# EAGLE design crt13n (EAGLE 7.6.0)
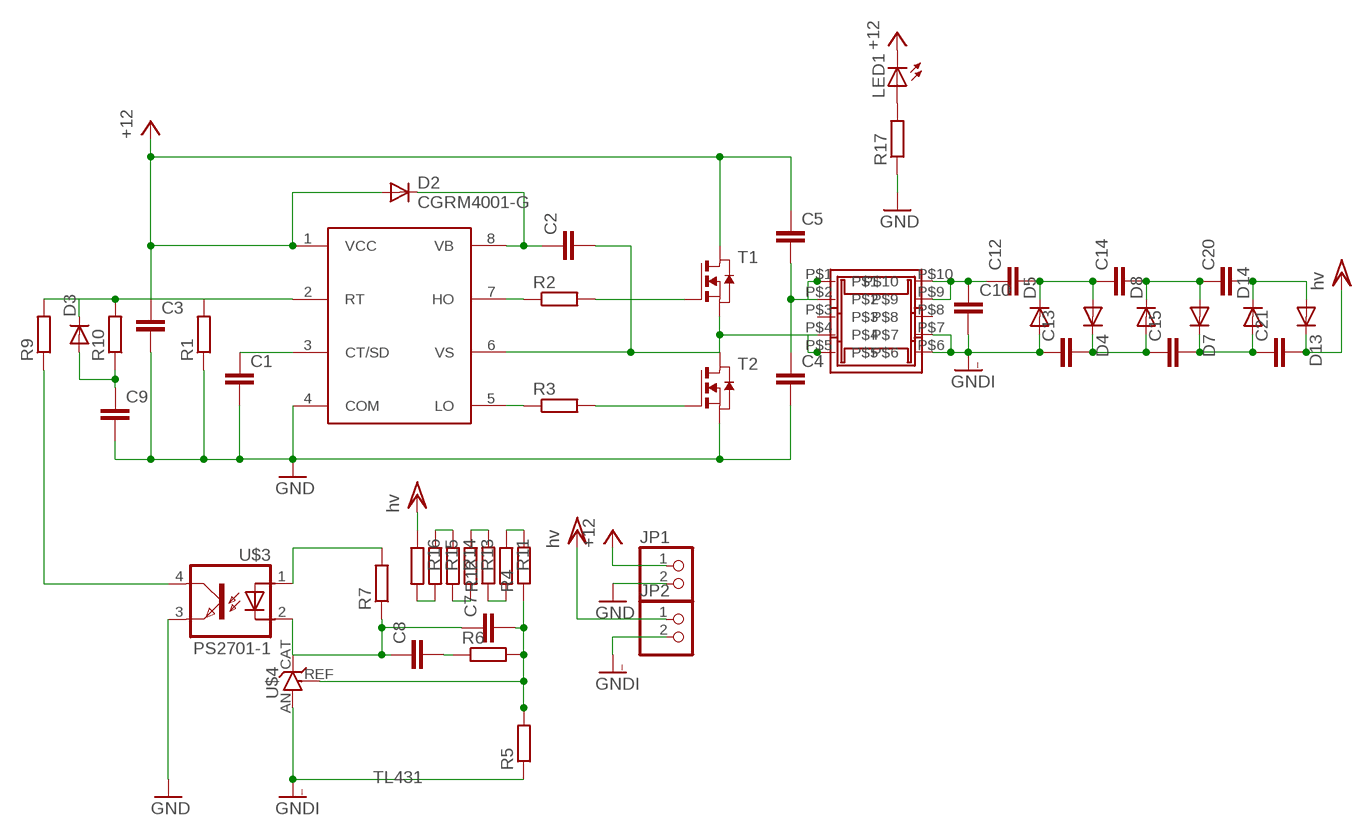
[diagram p0: schematic, sheet 1]

## Parts
C1  C-EUC0805  [C0805]
C2  C-EUC0805  [C0805]
C3  C-EUC1206  [C1206]
C4  CC1206  [C1206]
C5  CC1206  [C1206]
C7  C-EUC0805  [C0805]
C8  C-EUC0805  [C0805]
C9  C-EUC1206  [C1206]
C10  C-EUC1812  [C1812]
C12  C-EUC2220K  [C2220K]
C13  C-EUC2220K  [C2220K]
C14  C-EUC2220K  [C2220K]
C15  C-EUC2220K  [C2220K]
C20  C-EUC2220K  [C2220K]
C21  C-EUC2220K  [C2220K]
D2  CGRM4001-G  [SOD-123_MINI-SMA]
D3  DIODE-SOD80C  [SOD80C]
D4  DIODE-DO-214AC  [DO-214AC]
D5  DIODE-DO-214AC  [DO-214AC]
D7  DIODE-DO-214AC  [DO-214AC]
D8  DIODE-DO-214AC  [DO-214AC]
D13  DIODE-DO-214AC  [DO-214AC]
D14  DIODE-DO-214AC  [DO-214AC]
JP1  PINHD-1X2  [1X02]
JP2  PINHD-1X2  [1X02]
LED1  LEDCHIP-LED0805  [CHIP-LED0805]
R1  R-EU_R0805  [R0805]
R2  R-EU_R0805  [R0805]
R3  R-EU_R0805  [R0805]
R4  R-EU_R0805  [R0805]
R5  R-EU_R0805  [R0805]
R6  R-EU_R0805  [R0805]
R7  R-EU_R0805  [R0805]
R9  R-EU_R0805  [R0805]
R10  R-EU_R0805  [R0805]
R11  R-EU_R0805  [R0805]
R12  R-EU_R0805  [R0805]
R13  R-EU_R0805  [R0805]
R14  R-EU_R0805  [R0805]
R15  R-EU_R0805  [R0805]
R16  R-EU_R0805  [R0805]
R17  R-EU_R0805  [R0805]
T1  NMOSSOT23  [SOT-23]
T2  NMOSSOT23  [SOT-23]
U$1  IRS2795  [SO08]
U$2  EFD15-K-10P  [EFD15-K10P]
U$3  PS2701-1  [SOP04]
U$4  TL431  [SOT23]

## Nets
GND: C1.2 C3.2 C4.2 C9.2 JP1.2 R1.1 R17.1 T2.2(S) U$1.4(COM) U$3.3
GNDI: C10.2 C13.1 D5.A JP2.2 R5.1 U$2.P$6 U$2.P$7 U$4.AN
N$1: R7.2 U$3.1
N$2: C2.1 D2.C U$1.8(VB)
N$3: C1.1 U$1.3(CT/SD)
N$4: LED1.A R17.2
N$5: D3.C R1.2 R9.2 R10.2 U$1.2(RT)
N$6: R3.1 U$1.5(LO)
N$7: R2.1 U$1.7(HO)
N$10: C2.2 T1.2(S) T2.1(D) U$1.6(VS) U$2.P$4 U$2.P$5
N$11: R3.2 T2.3(G)
N$12: R2.2 T1.3(G)
N$13: C7.2 R4.1 R5.2 R6.2 U$4.REF
N$14: C8.2 R6.1
N$15: C7.1 C8.1 R7.1 U$3.2 U$4.CAT
N$16: R9.1 U$3.4
N$17: R4.2 R11.1
N$18: R11.2 R12.1
N$19: C10.1 C12.1 U$2.P$9 U$2.P$10
N$20: R12.2 R13.1
N$21: C9.1 D3.A R10.1
N$22: C12.2 C14.1 D4.A D5.C
N$23: R13.2 R14.2
N$24: R14.1 R15.1
N$25: R15.2 R16.2
N$27: C13.2 C15.1 D4.C D8.A
N$28: C14.2 C20.1 D7.A D8.C
N$31: C20.2 D13.A D14.C
N$32: C15.2 C21.1 D7.C D14.A
N$37: C4.1 C5.2 U$2.P$1 U$2.P$2
VCC: C3.1 C5.1 D2.A JP1.1 LED1.C T1.1(D) U$1.1(VCC) ; supply symbol labelled +12
VCC/2: C21.2 D13.C JP2.1 R16.1 ; supply symbol labelled hv
Unconnected: U$2.P$3 U$2.P$8

## Library data of the parts
C1-C3 C7-C10 C12-C15 C20 C21 = rcl:C-EU: CAPACITOR, European symbol
C4 C5 = eagle-ltspice:C: CAPACITOR, European symbol; SPICEMODEL: NONE; SPICEPREFIX: C
D2 = diode:CGRM400*-G: Molded plasitc,JEDEC SOD-123/Mini SMA Source: Comchip CGRM4001-G.pdf
D3-D5 D7 D8 D13 D14 = diode:DIODE-: DIODE
JP1 JP2 = pinhead:PINHD-1X2: PIN HEADER
LED1 = adafruit:LED: LED OSRAM: - CHIPLED LG R971, LG N971, LY N971, LG Q971, LY Q971, LO R971, LY R971 LH N974, LH R974 LS Q976, LO Q976, LY Q976 LO Q996 - Hyper CHIPLED LW Q18S LB Q993, LB Q99A, LB R99A - SideLED LS A670, LO A670, LY A670, LG A670, LP A670 LB A673, LV A673, LT A673, LW A673 LH A674 LY A675 LS A676, LA A676, LO A676, LY A676, LW A676 LS A679, LY A679, LG A679 - Hyper Micro SIDELED® LS Y876, LA Y876, LO Y876, LY Y876 LT Y87S - SmartLED LW L88C, LW L88S LB L89C, LB L89S, LG L890 LS L89K, LO L89K, LY L89K LS L896, LA L896, LO L896, LY L896 - TOPLED LS T670, LO T670, LY T670, LG T670, LP T670 LSG T670, LSP T670, LSY T670, LOP T670, LYG T670 LG T671, LOG T671, LSG T671 LB T673, LV T673, LT T673, LW T673 LH T674 LS T676, LA T676, LO T676, LY T676, LB T676, LH T676, LSB T676, LW T676 LB T67C, LV T67C, LT T67C, LS T67K, LO T67K, LY T67K, LW E67C LS E67B, LA E67B, LO E67B, LY E67B, LB E67C, LV E67C, LT E67C LW T67C LS T679, LY T679, LG T679 LS T770, LO T770, LY T770, LG T770, LP T770 LB T773, LV T773, LT T773, LW T773 LH T774 LS E675, LA E675, LY E675, LS T675 LS T776, LA T776, LO T776, LY T776, LB T776 LHGB T686 LT T68C, LB T68C - Hyper Mini TOPLED® LB M676 - Mini TOPLED Santana® LG M470 LS M47K, LO M47K, LY M47K Source: http://www.osram.convergy.de/
R1-R7 R9-R17 = rcl:R-EU_: RESISTOR, European symbol
T1 T2 = zetex:NMOSSOT23: MOS FET; OC_FARNELL: unknown; OC_NEWARK: unknown
U$1 = ir:IRS2795
U$2 = EFD15-K-10P:EFD15-K-10P
U$3 = PHOTOCOUPLER:PS2701-1
U$4 = reg:TL431

## Board
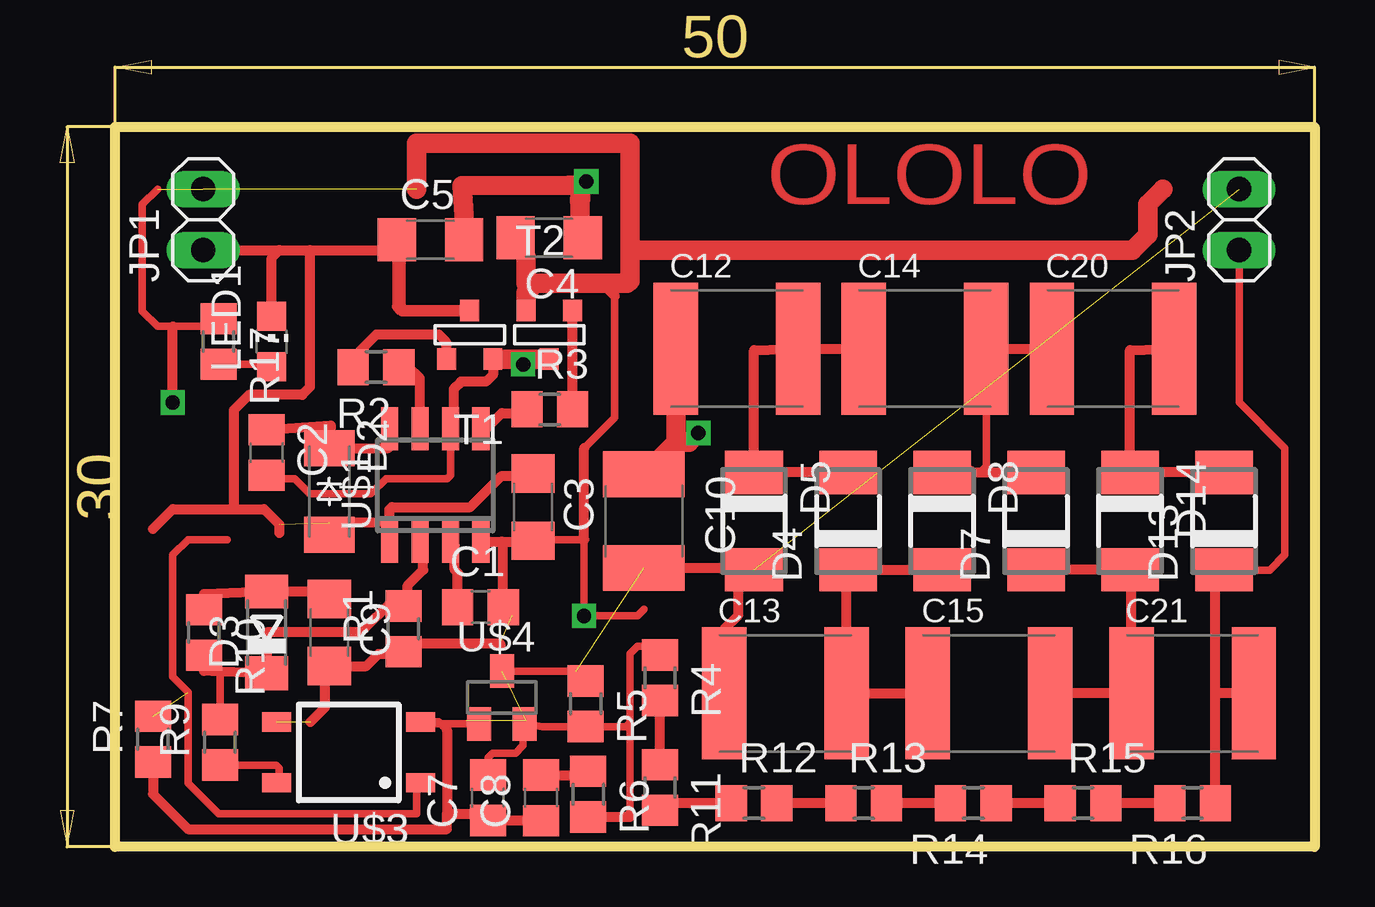
[diagram p1: board, top side]
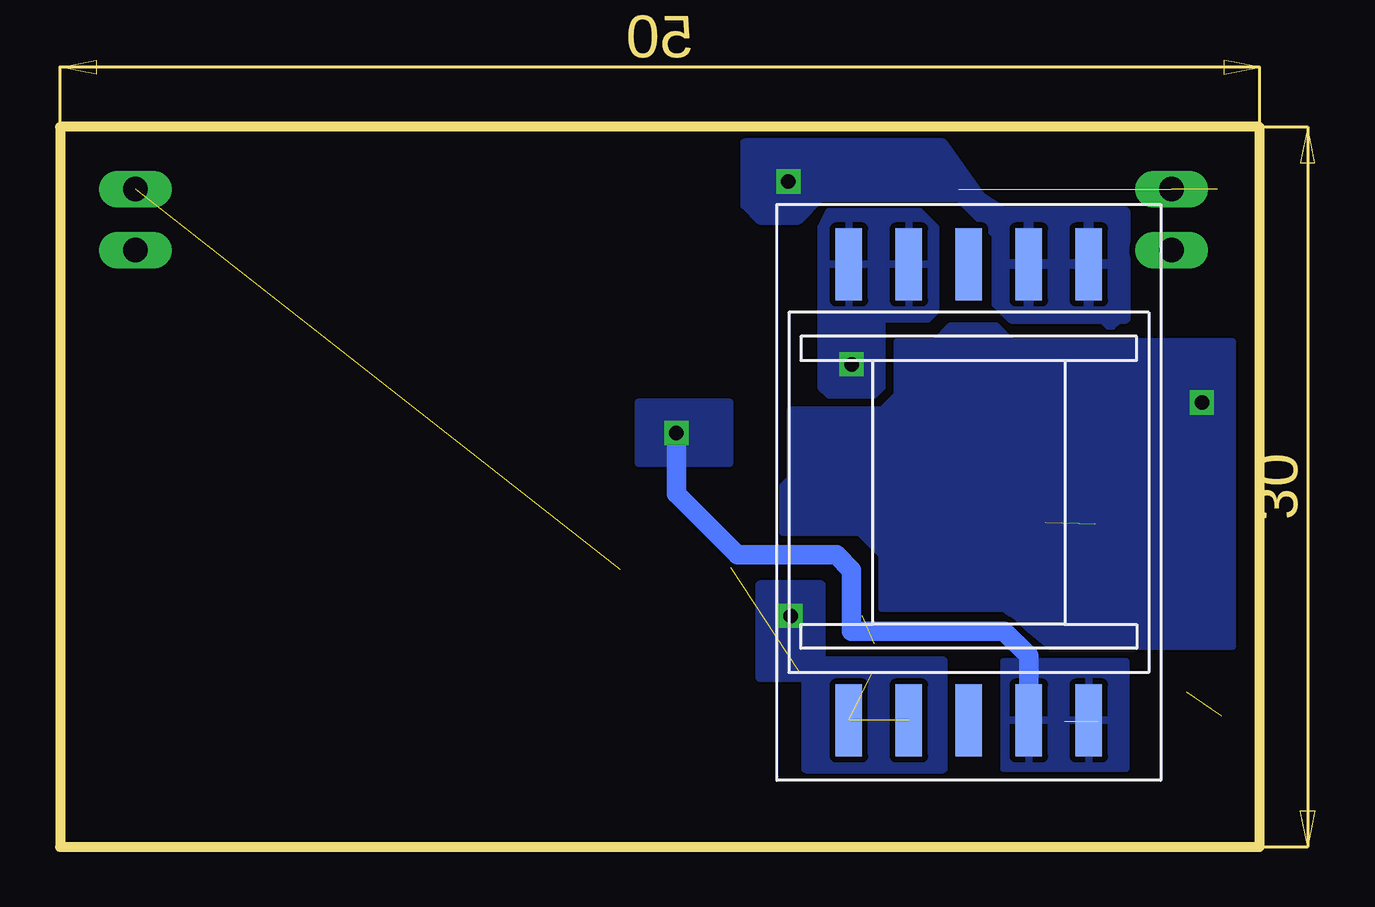
[diagram p2: board, bottom side, seen from below]

Size 50 x 30 mm. Coordinates in mm from the lower left corner, seen from the top.
Outline: 0,30 50,30 50,0 0,0 0,30
Copper layers (1*16): Top 0.035mm / dielectric 1.5mm / Bottom 0.035mm
Design rules "default *": minimum track width 0.25mm, minimum drill 24mil, track to track 0.25mm, track to pad 0.25mm, pad to pad 8mil, via to via 8mil, smd to smd 8mil, copper to edge 0.25mm, drill to drill 8mil, minimum pad ring 10mil, minimum via ring 8mil, stop-mask expansion 4mil, vias tented up to drill 0mil, thermal gap 10mil

### Footprints (pad centres in the part's own frame; a part is rotated, then mirrored left to right if it is on the bottom)
C0805 = smd 1.3 x 1.5: 1 -0.95,0; 2 0.95,0
C1206 = smd 1.6 x 1.8: 1 -1.4,0; 2 1.4,0
C1812 = smd 1.9 x 3.4: 1 -1.95,0; 2 1.95,0
C2220K = smd 1.85 x 5.5: 1 -2.55,0; 2 2.55,0
SOD-123_MINI-SMA = smd 1.5 x 2.1: A 1.8,0; C -1.8,0
SOD80C = smd 1.4 x 1.8: A 1.7,0; C -1.7,0
DO-214AC = smd 1.8 x 2.4: A 2.025,0; C -2.025,0
1X02 = drill 1.016 long: 1 -1.27,0; 2 1.27,0
CHIP-LED0805 = smd 1.2 x 1.2: A 0,-1.05; C 0,1.05
R0805 = smd 1.3 x 1.5: 1 -0.95,0; 2 0.95,0
SOT-23 = smd 0.787 x 0.889: 1 0.025,-1.016; 2 -0.94,1.016; 3 0.991,1.016
SO08 = smd 0.72 x 1.78: 1 -1.905,-2.35; 2 -0.635,-2.35; 3 0.635,-2.35; 4 1.905,-2.35; 5 1.905,2.35; 6 0.635,2.35; 7 -0.635,2.35; 8 -1.905,2.35
EFD15-K10P = smd 3 x 1.1: P$1 -9.46,5.38; P$2 -9.46,2.88; P$3 -9.46,0.38; P$4 -9.46,-2.12; P$5 -9.46,-4.62; P$6 9.54,-4.62; P$7 9.54,-2.12; P$8 9.54,0.38; P$9 9.54,2.88; P$10 9.54,5.38
SOP04 = smd 0.8 x 1.2: 1 -1.27,-3; 2 1.27,-3; 3 1.27,3; 4 -1.27,3
SOT23 = smd 1 x 1.4: AN 0,1.1; CAT -0.95,-1.1; REF 0.95,-1.1

### Placement (x,y rotation side)
C1  15.23,10 0 top
C2  6.31,16.44 270 top
C3  17.41,14.16 270 top
C4  18.09,25.38 180 top
C5  13.14,25.3 0 top
C7  15.54,2.05 90 top
C8  17.75,2.05 90 top
C9  8.93,8.94 270 top
C10  22.04,13.58 270 top
C12  25.92,20.76 0 top
C13  27.93,6.4 0 top
C14  33.76,20.76 0 top
C15  36.42,6.4 0 top
C20  41.59,20.76 0 top
C21  44.91,6.4 0 top
D2  8.93,14.81 270 top
D3  6.31,8.94 90 top
D4  30.55,13.58 90 top
D5  26.63,13.58 270 top
D7  38.38,13.58 90 top
D8  34.46,13.58 270 top
D13  46.22,13.58 90 top
D14  42.3,13.58 270 top
JP1  3.67,26.14 90 top
JP2  46.85,26.14 90 top
LED1  6.53,21.06 0 top
R1  12.02,9.09 90 top
R2  10.87,19.99 180 top
R3  18.11,18.23 0 top
R4  22.71,7.05 270 top
R5  19.61,5.97 270 top
R6  19.71,2.2 270 top
R7  1.57,4.49 90 top
R9  4.37,4.36 90 top
R10  3.7,8.94 270 top
R11  22.71,2.48 270 top
R12  26.63,1.82 0 top
R13  31.2,1.82 0 top
R14  35.77,1.82 180 top
R15  40.34,1.82 0 top
R16  44.91,1.82 180 top
R17  4.3,21.06 270 top
T1  14.8,21.34 180 top
T2  18.07,21.34 0 top
U$1  13.34,15.07 0 top
U$2  12.5,14.81 270 bottom
U$3  9.73,3.94 90 top
U$4  16.12,6.23 0 top

### Tracks (layer width: path | path; a pad name or v marks a point on that pad's centre or on a via)
GND  (via drill 0.6)  (4 unrouted)
  Top 0.305: 19.55,16.61 20.81,17.88 20.81,22.97 | 1.77,27.41 1.13,26.77 1.13,22.33 1.77,21.7 2.4,21.7 3.99,21.7 R17.1 | 17.13,23.48 17.32,23.28 | 17.13,24.59 17.13,24.62 C4.2 | C3.2 17.46,12.8 19.55,12.8 v19.55,9.63 21.77,9.63 22.04,9.9 | 16.54,9.63 C1.2 16.12,9.94 | 16.12,8.39 16.05,8.46
  Top 0.406: U$1.4 16.11,12.73 | 16.11,12.73 17.38,12.73 C3.2 | C1.2 16.18,12.65 16.11,12.73 | 8.14,5.21 8.75,5.82 8.75,7.36 C9.2 10.47,7.54 10.97,8.04 11.92,8.04 R1.1 12.33,8.46 16.05,8.46 | 19.55,12.8 19.55,16.61 | v2.4,18.52 2.4,21.7 | 20.3,23.48 20.81,22.97
  Top 0.813: 17.13,24.59 17.13,23.48 20.3,23.48 21.33,23.48 21.45,23.6 21.45,24.87 | 12.56,27.41 12.56,29.31 21.45,29.31 21.45,24.87 | 21.45,24.87 42.41,24.87 43.04,25.51 43.04,26.77 43.67,27.41 | T2.2 17.13,23.09 17.32,23.28
  pour Bottom: 13.2,3.28 13.2,7.73 18.27,7.73 18.27,10.9 20.81,10.9 20.81,7.09 18.91,7.09 18.91,3.28
  pour Bottom: 1.13,8.36 8.75,8.36 10.66,9.95 15.73,9.95 15.73,12.17 16.69,13.12 19.86,13.12 19.86,15.03 19.55,15.34 19.55,18.2 15.73,18.2 15.1,18.84 15.1,21.06 13.51,21.06 12.88,21.7 10.97,21.7 10.34,21.06 1.13,21.06
GNDI  (4 unrouted)
  Top 0.305: U$4.AN 19.2,7.33 R5.1
  Top 0.406: C10.2 26.55,11.63 D5.A 25.98,10.9 25.98,9.66 25.38,9.07 C13.1
N$1  (1 unrouted)
  Top 0.305: 4.66,12.8 3.04,12.8 2.4,12.17 2.4,7.09 3.04,6.45 3.04,2.64 4.3,1.38 12.56,1.38 12.56,2.5 U$3.1
N$2
  Top 0.406: C2.1 8.99,17.57 D2.C 11.38,16.61 11.54,16.77 11.54,17.32 U$1.8
N$3
  Top 0.406: C1.1 14.28,11.42 14.15,11.55 14.15,12.55 U$1.3
N$4
  Top 0.305: R17.2 6.43,20.11 LED1.A
N$5
  Top 0.305: R9.2 4.37,7.25 4.31,7.31
  Top 0.406: R10.2 3.7,7.33 4.31,7.31 D3.C 6.31,8.94 10.23,8.94 11.54,10.24 12.02,10.24 | R1.2 12.02,10.24 | 12.02,10.24 12.19,10.24 12.19,10.89 12.84,11.55 12.84,12.59 U$1.2
N$6
  Top 0.406: U$1.5 15.45,17.43 16.11,18.08 17.01,18.08 R3.1
N$7
  Top 0.406: U$1.7 12.71,19.52 12.19,20.04 11.87,20.04 R2.1
N$10  (via drill 0.6)
  Top 0.305: v17.01,20.11 17.01,20.33 | U$1.6 13.98,15.49 13.83,15.34 11.29,15.34 10.66,14.71 8.11,14.71 7.48,15.34 6.45,15.34 C2.2
  Top 0.406: T1.2 15.74,19.67 15.45,19.38 14.42,19.38 14.11,19.08 14.11,17.56 U$1.6
  Top 0.813: T2.1 17.01,20.33 T1.2
  pour Bottom: 17.96,18.84 16.05,18.84 15.73,19.16 15.73,22.01 13.83,22.01 13.51,22.33 13.51,25.82 14.15,26.46 17.96,26.46 18.27,25.82 18.27,19.16
N$11
  Top 0.406: R3.2 T2.3
N$12
  Top 0.406: T1.3 13.81,21.03 13.5,21.34 10.88,21.34 10.23,20.69 10.23,20.3 R2.2
N$13
  Top 0.305: 21.45,1.38 21.45,5.18 | 21.45,5.18 21.45,8.04 21.77,8.36 22.44,8.36 R4.1 | 21.45,5.18 21.28,5.02 R5.2 17.81,5.02 U$4.REF 17.01,5.06 17.01,4.23 16.69,3.91 15.73,3.91 15.53,3.71 C7.2 15.36,2.86
  Top 0.406: R6.2 21.45,1.25 21.45,1.38
N$14
  Top 0.305: 19.56,2.68 R6.1
  Top 0.406: C8.2 19.71,3 R6.1
N$15
  Top 0.305: 13.83,4.87 13.49,5.21 U$3.2 12.82,5.13 U$4.CAT | 17.75,0.78 C8.1
  Top 0.406: C8.1 C7.1 15.53,1.38 13.83,1.38 | 13.83,4.87 13.83,1.38 | R7.1 1.57,2.2 3.04,0.74 13.83,0.74 13.83,1.38
N$16
  Top 0.305: R9.1 6.71,3.41 6.84,3.28 6.84,2.78 U$3.4
N$17
  Top 0.406: R11.1 R4.2
N$18
  Top 0.406: R12.1 23.01,1.82 R11.2
N$19  (via drill 0.6)
  Top 0.813: 22.09,15.57 C10.1 23.37,16.86 | C12.1 23.37,16.86 | 23.37,16.86 23.92,16.86 v24.31,17.25
  Bottom 0.813: U$2.P$9 9.62,7.96 10.66,9 17.01,9 17.01,11.54 17.64,12.17 21.77,12.17 24.31,14.71 v24.31,17.25
  pour Bottom: 5.57,3.28 10.66,3.28 10.66,7.73 5.57,7.73
  pour Bottom: 22.09,18.52 22.09,15.98 25.9,15.98 25.9,18.52
N$20
  Top 0.406: R13.1 R12.2
N$21
  Top 0.406: R10.1 3.7,10.54 D3.A 8.93,10.64 C9.1
N$22
  Top 0.406: C14.1 C12.2 26.63,20.7 D5.C D4.A
N$23
  Top 0.406: R14.2 R13.2
N$24
  Top 0.406: R15.1 R14.1
N$25
  Top 0.406: R16.2 R15.2
N$27
  Top 0.406: C15.1 C13.2 30.48,11.49 D4.C D8.A
N$28
  Top 0.305: C14.2 36.31,15.86 36.05,15.6
  Top 0.406: C14.2 C20.1 | 35.67,15.67 D8.C 36.05,15.6 D7.A
N$31
  Top 0.406: C20.2 42.3,20.7 D14.C D13.A
N$32
  Top 0.406: D7.C D14.A 42.36,11.49 C21.1 C15.2
N$37  (via drill 0.6)
  Top 0.305: v19.64,27.73 18.75,27.73 18.91,27.57
  Top 0.813: C5.2 14.54,26.33 14.47,27.56 18.91,27.57 19.39,27.57 | 19.39,27.57 19.37,26.22 C4.1 | 19.35,26.9 19.39,27.57
  pour Bottom: 5.89,22.01 5.57,22.01 5.57,26.46 10.66,26.46 11.61,27.09 13.2,29.31 21.45,29.31 21.45,26.77 20.81,26.14 19.23,26.14 18.27,27.09 12.56,27.09 10.97,25.51 10.97,22.65 10.34,22.01 6.53,22.01 6.21,21.7
VCC  (1 unrouted)
  Top 0.406: U$1.1 11.44,13.61 | 11.44,13.61 10.88,13.51 8.93,13.51 D2.A | 11.44,13.61 11.44,14.06 11.54,14.16 14.8,14.16 16.11,15.47 17.32,15.47 C3.1 | 1.57,13.25 2.4,14.07 4.94,14.07 | 4.94,14.07 6.21,14.07 6.84,13.44 6.84,13.09 | JP1.1 6.84,24.87 | 6.84,24.87 8.11,24.87 | 8.11,24.87 11.63,24.87 | 11.63,24.87 C5.1 11.74,22.51 11.92,22.33 | LED1.C 6.53,24.55 6.84,24.87 | 11.92,22.33 14.75,22.33 T1.1 11.95,22.36 11.92,22.33 | 11.92,22.33 11.92,24.87 11.63,24.87 | 8.11,24.87 8.11,19.16 7.8,18.84 5.57,18.84 4.94,18.2 4.94,14.07
VCC/2
  Top 0.305: JP2.1 46.85,18.52 48.75,16.61 48.75,12.17 48.12,11.54 46.24,11.54 D13.C
  Top 0.406: R16.1 45.86,6.45 | 45.86,6.45 45.86,11.2 D13.C | C21.2 45.92,6.4 45.86,6.45

### Text on the board
Top: OLOLO